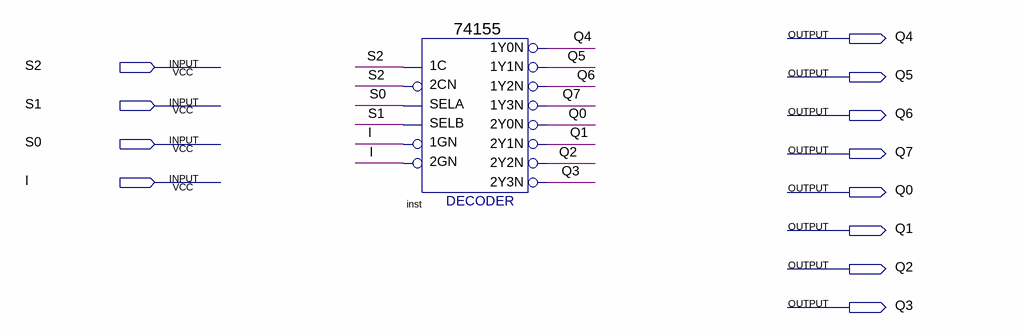
[diagram p0: schematic sheet]
// Quartus schematic one_multiply_eight_Demux_seven_four_one_five_five.bdf as structural Verilog: 1 symbols, 12 pins
module one_multiply_eight_Demux_seven_four_one_five_five (
  input  S2,
  input  S1,
  input  S0,
  input  I,
  output Q4,
  output Q5,
  output Q6,
  output Q7,
  output Q0,
  output Q1,
  output Q2,
  output Q3
);

  \74155  inst (
    .\1C (S2), .\2CN (S2), .SELB(S1), .SELA(S0), .\1GN (I), .\2GN (I), .\1Y2N (Q6), .\1Y1N (Q5), .\1Y0N (Q4),
    .\2Y1N (Q1), .\2Y0N (Q0), .\1Y3N (Q7), .\2Y3N (Q3), .\2Y2N (Q2));
endmodule
